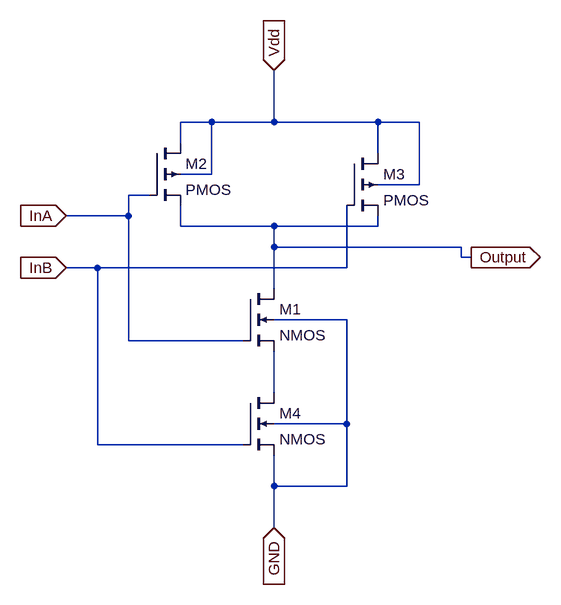
[diagram p0: schematic Nand2.asc]
Nand2.asc, the LTspice schematic file:
Version 4
SHEET 1 880 944
WIRE -256 144 -304 144
WIRE -160 144 -160 64
WIRE -160 144 -256 144
WIRE 0 144 -160 144
WIRE 64 144 0 144
WIRE -304 176 -304 144
WIRE 0 192 0 144
WIRE -256 224 -256 144
WIRE -256 224 -304 224
WIRE 64 240 64 144
WIRE 64 240 0 240
WIRE -352 256 -384 256
WIRE -384 288 -384 256
WIRE -384 288 -480 288
WIRE -304 304 -304 272
WIRE -160 304 -304 304
WIRE 0 304 0 288
WIRE 0 304 -160 304
WIRE -160 336 -160 304
WIRE 128 336 -160 336
WIRE 128 352 128 336
WIRE 144 352 128 352
WIRE -432 368 -480 368
WIRE -48 368 -48 272
WIRE -48 368 -432 368
WIRE -160 400 -160 336
WIRE -48 448 -160 448
WIRE -384 480 -384 288
WIRE -208 480 -384 480
WIRE -160 560 -160 496
WIRE -48 608 -48 448
WIRE -48 608 -160 608
WIRE -432 640 -432 368
WIRE -208 640 -432 640
WIRE -160 704 -160 656
WIRE -48 704 -48 608
WIRE -48 704 -160 704
WIRE -160 768 -160 704
FLAG -480 288 InA
IOPIN -480 288 In
FLAG -480 368 InB
IOPIN -480 368 In
FLAG -160 768 GND
IOPIN -160 768 In
FLAG -160 64 Vdd
IOPIN -160 64 In
FLAG 144 352 Output
IOPIN 144 352 Out
SYMBOL pmos4 -352 176 R0
SYMATTR InstName M2
SYMBOL pmos4 -48 192 R0
SYMATTR InstName M3
SYMBOL nmos4 -208 400 R0
SYMATTR InstName M1
SYMBOL nmos4 -208 560 R0
SYMATTR InstName M4

The netlist it stands for:
* Nand2.asc
M2 Vdd InA Output Vdd PMOS
M3 Vdd InB Output Vdd PMOS
M1 Output InA N001 GND NMOS
M4 N001 InB GND GND NMOS
.model NMOS NMOS
.model PMOS PMOS
.lib standard.mos
.backanno
.end